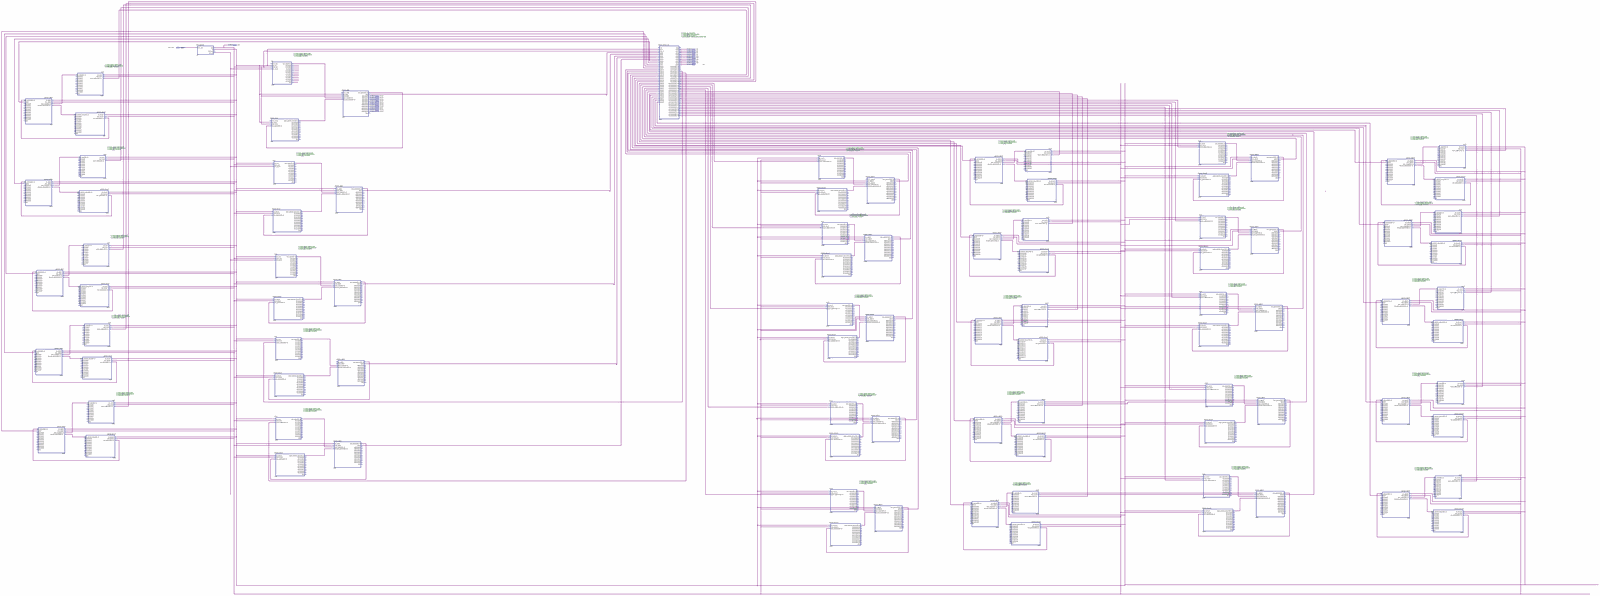
[diagram p0: schematic sheet, whole]
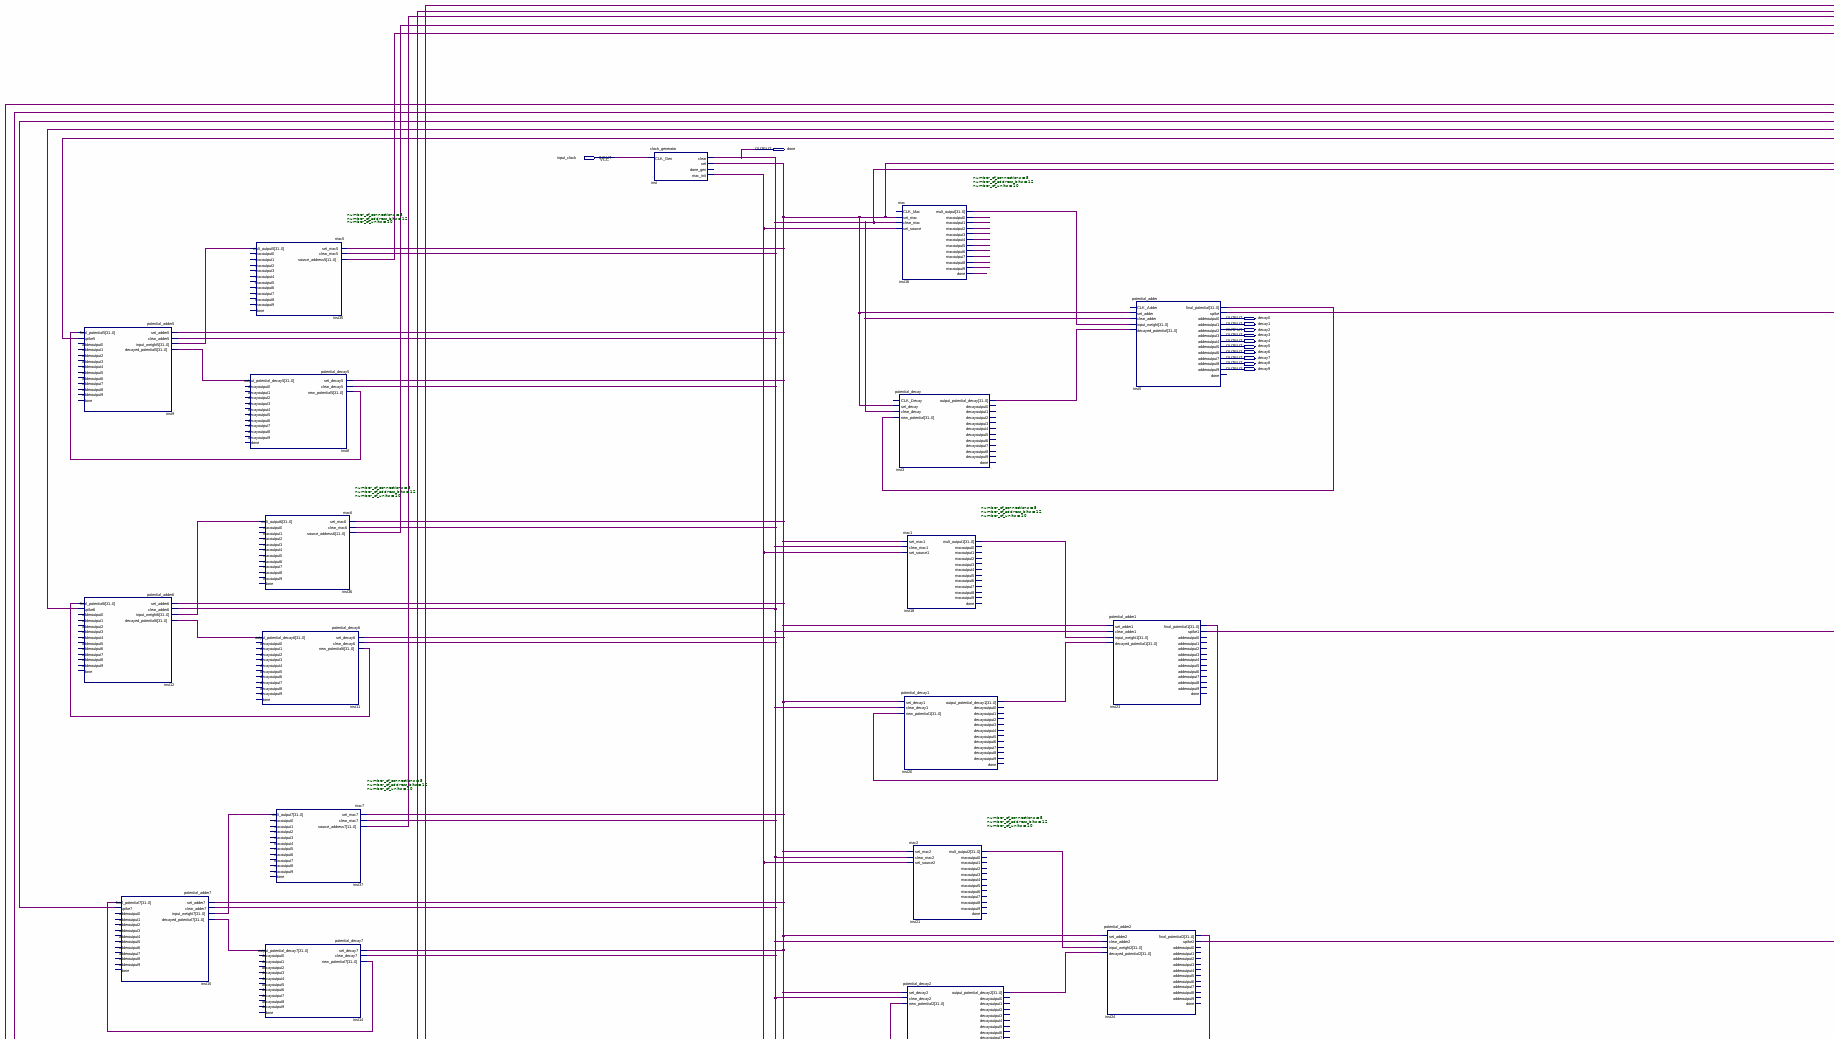
[diagram p1: schematic sheet, upper left part]
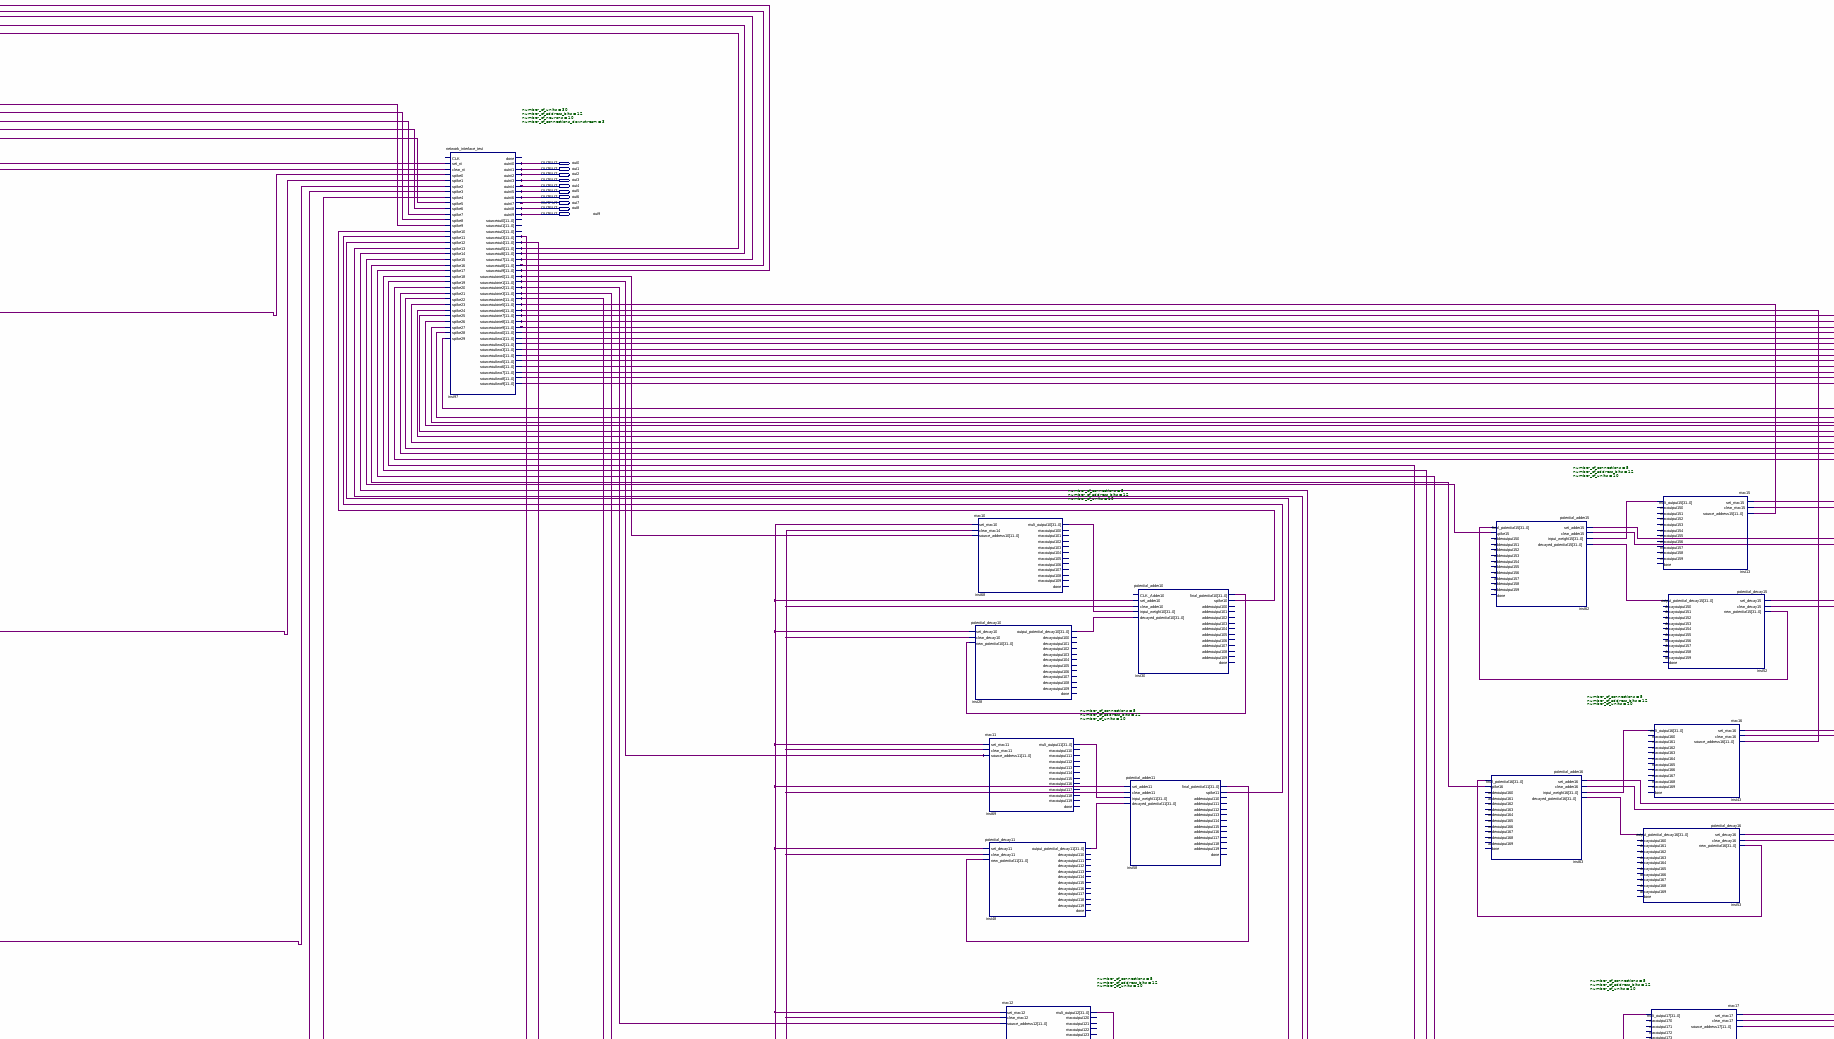
[diagram p2: schematic sheet, upper centre part]
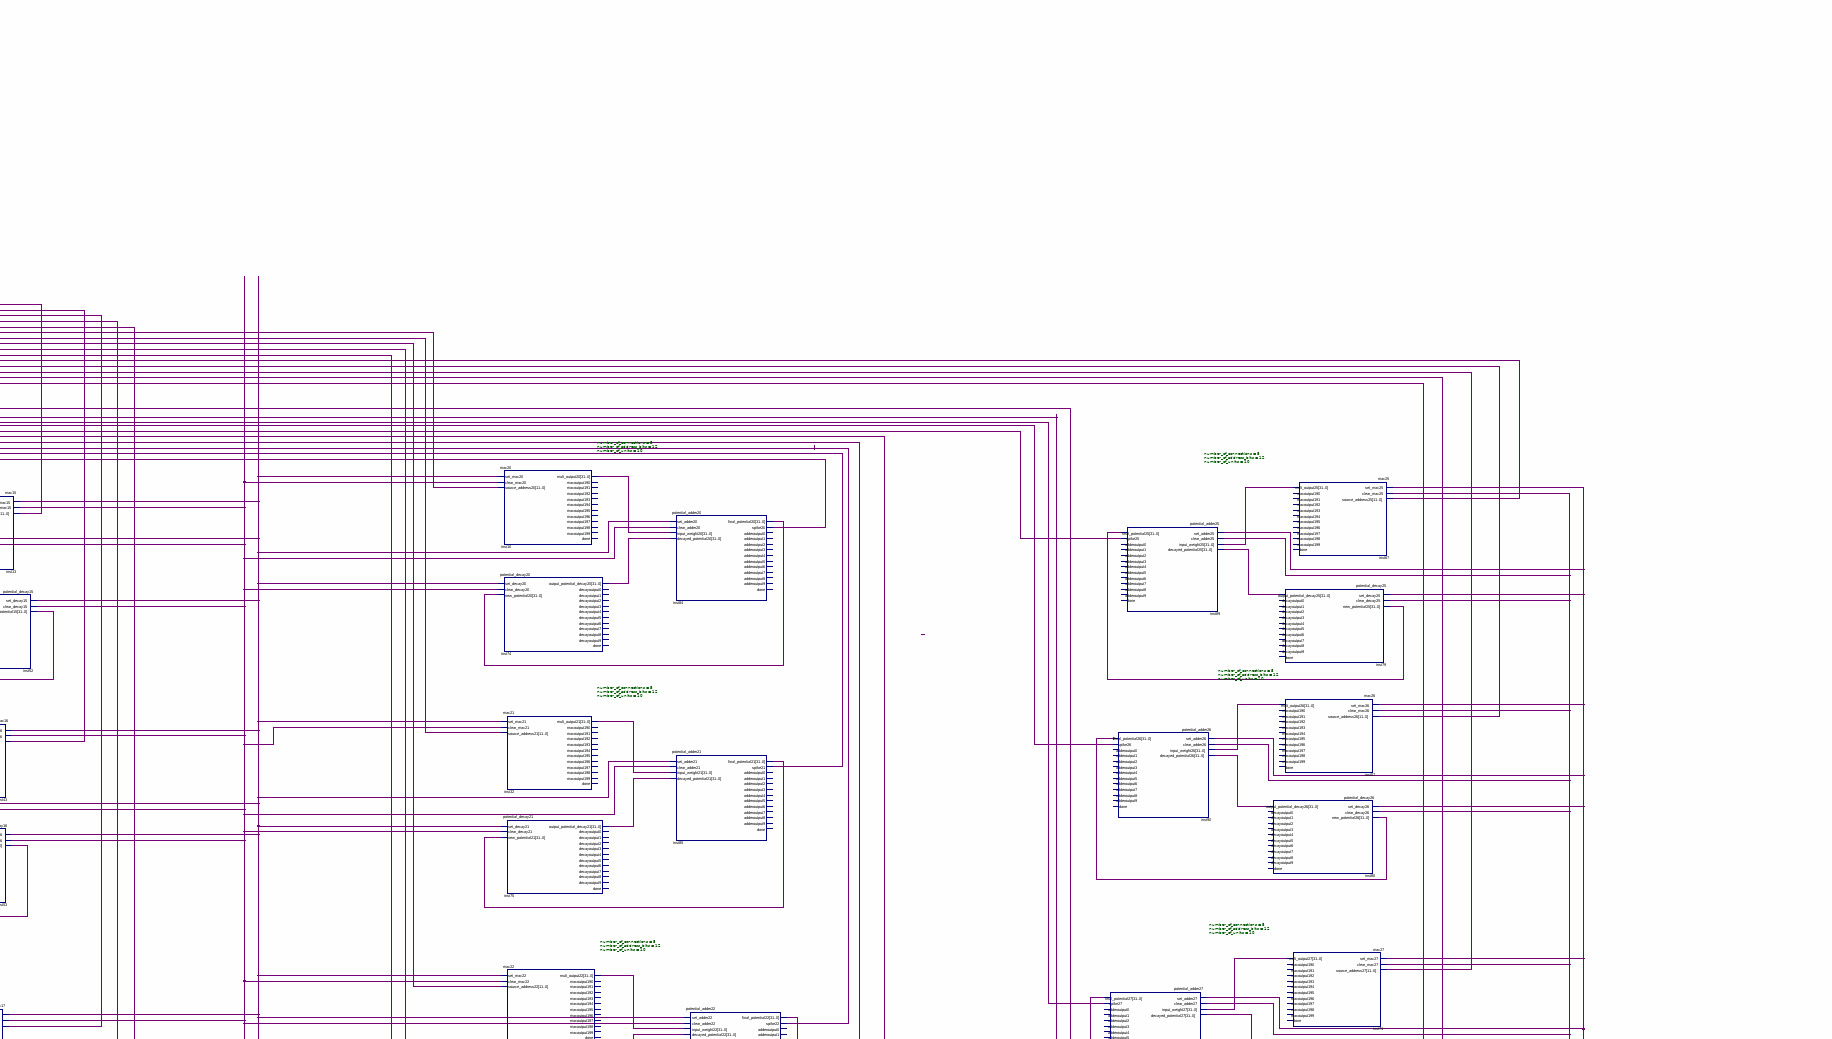
[diagram p3: schematic sheet, upper right part]
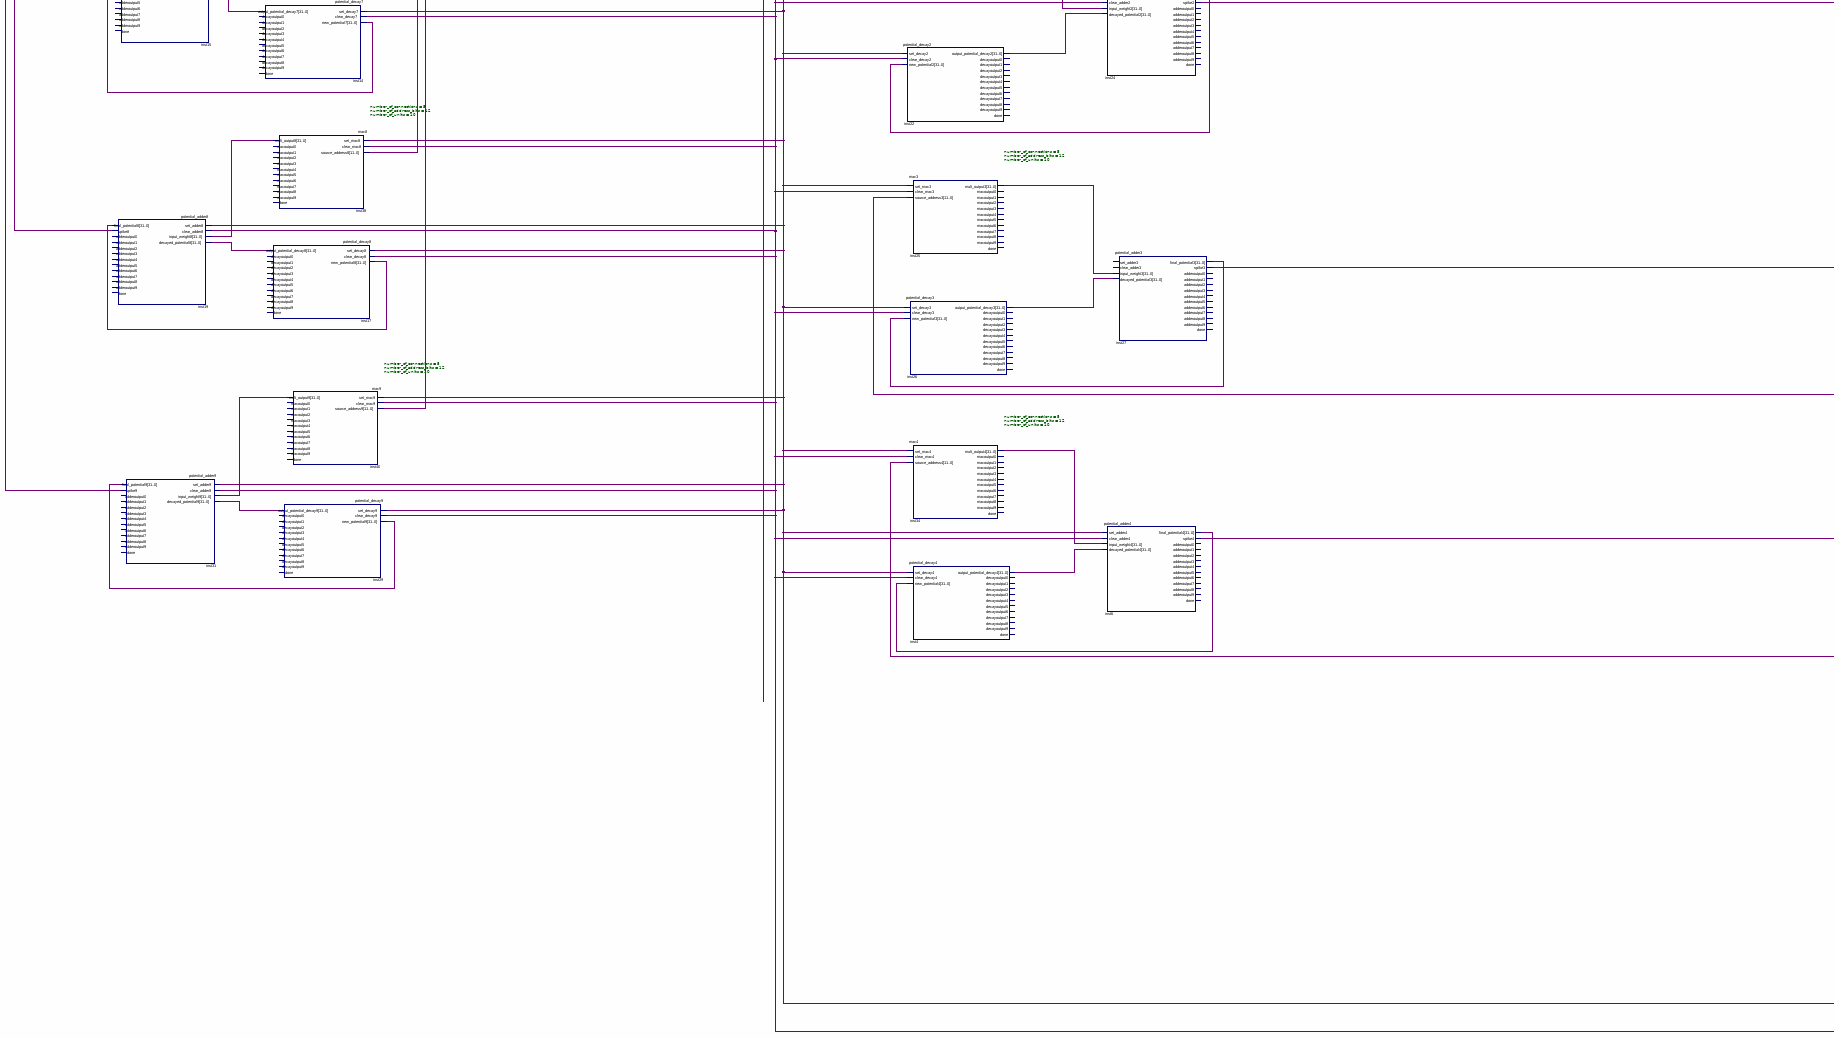
[diagram p4: schematic sheet, lower left part]
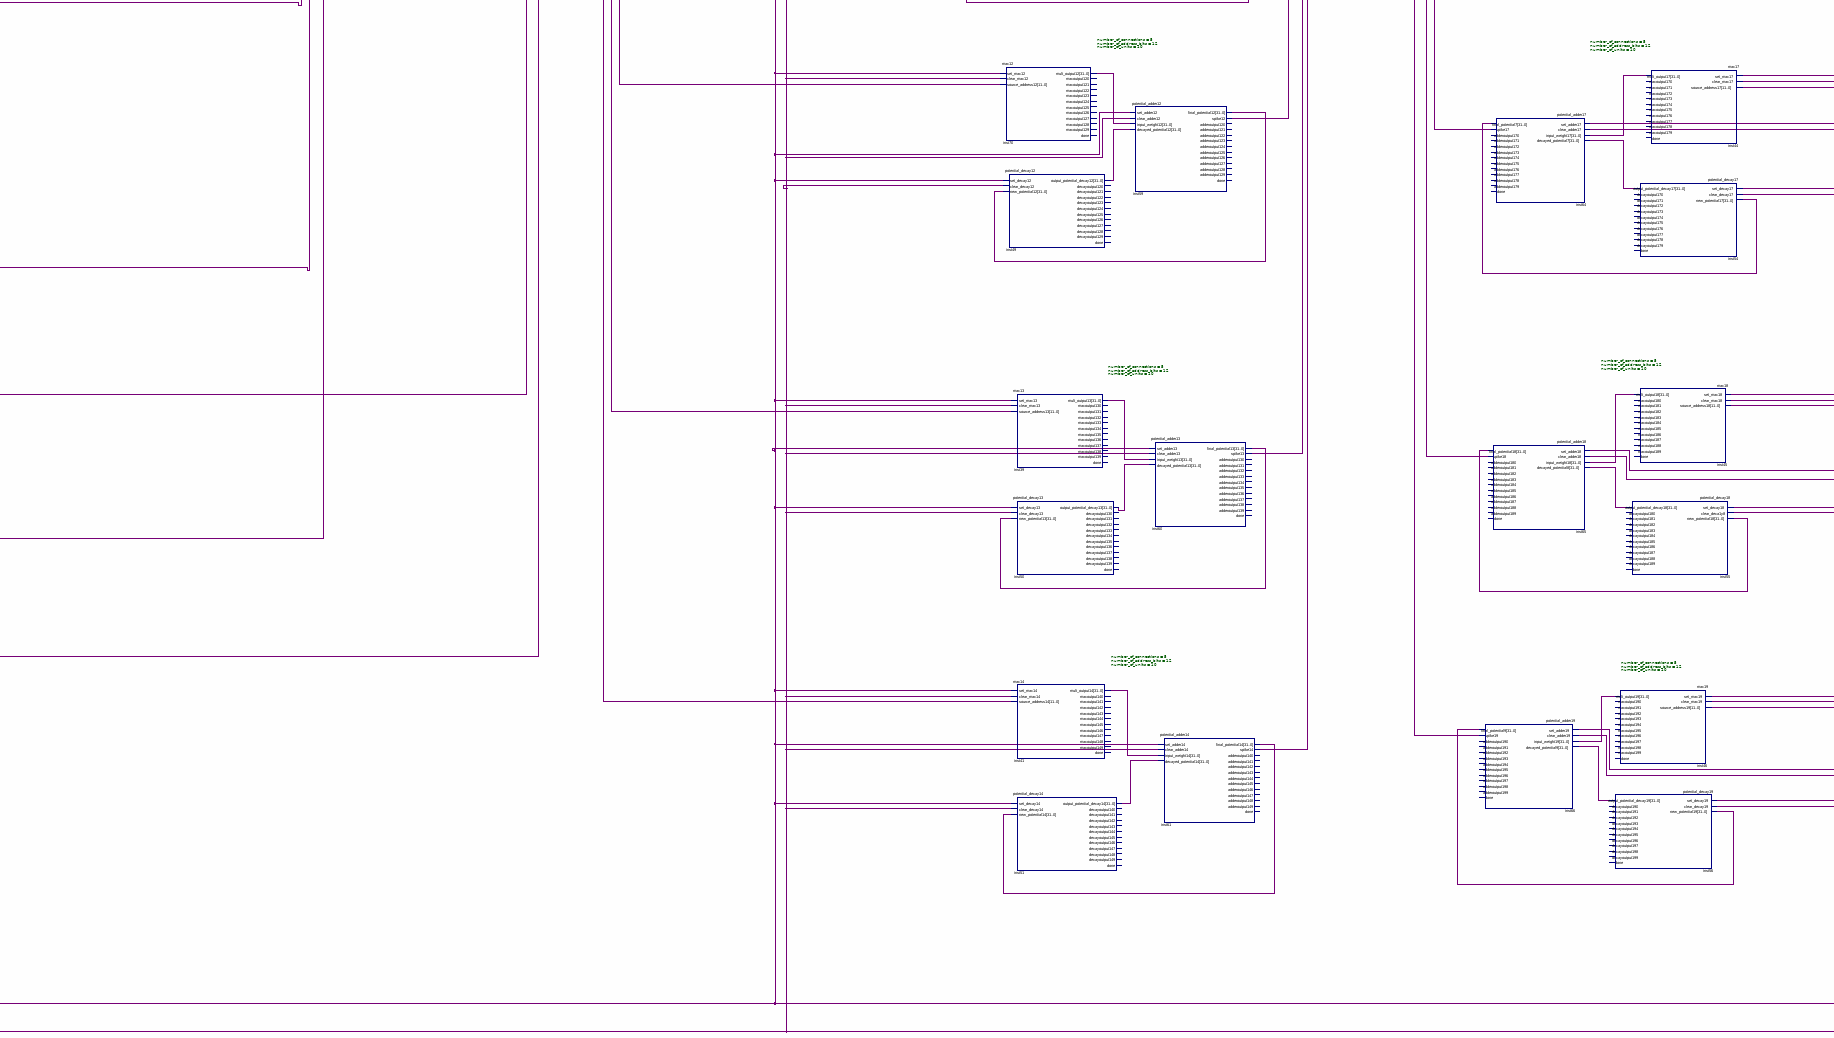
[diagram p5: schematic sheet, lower centre part]
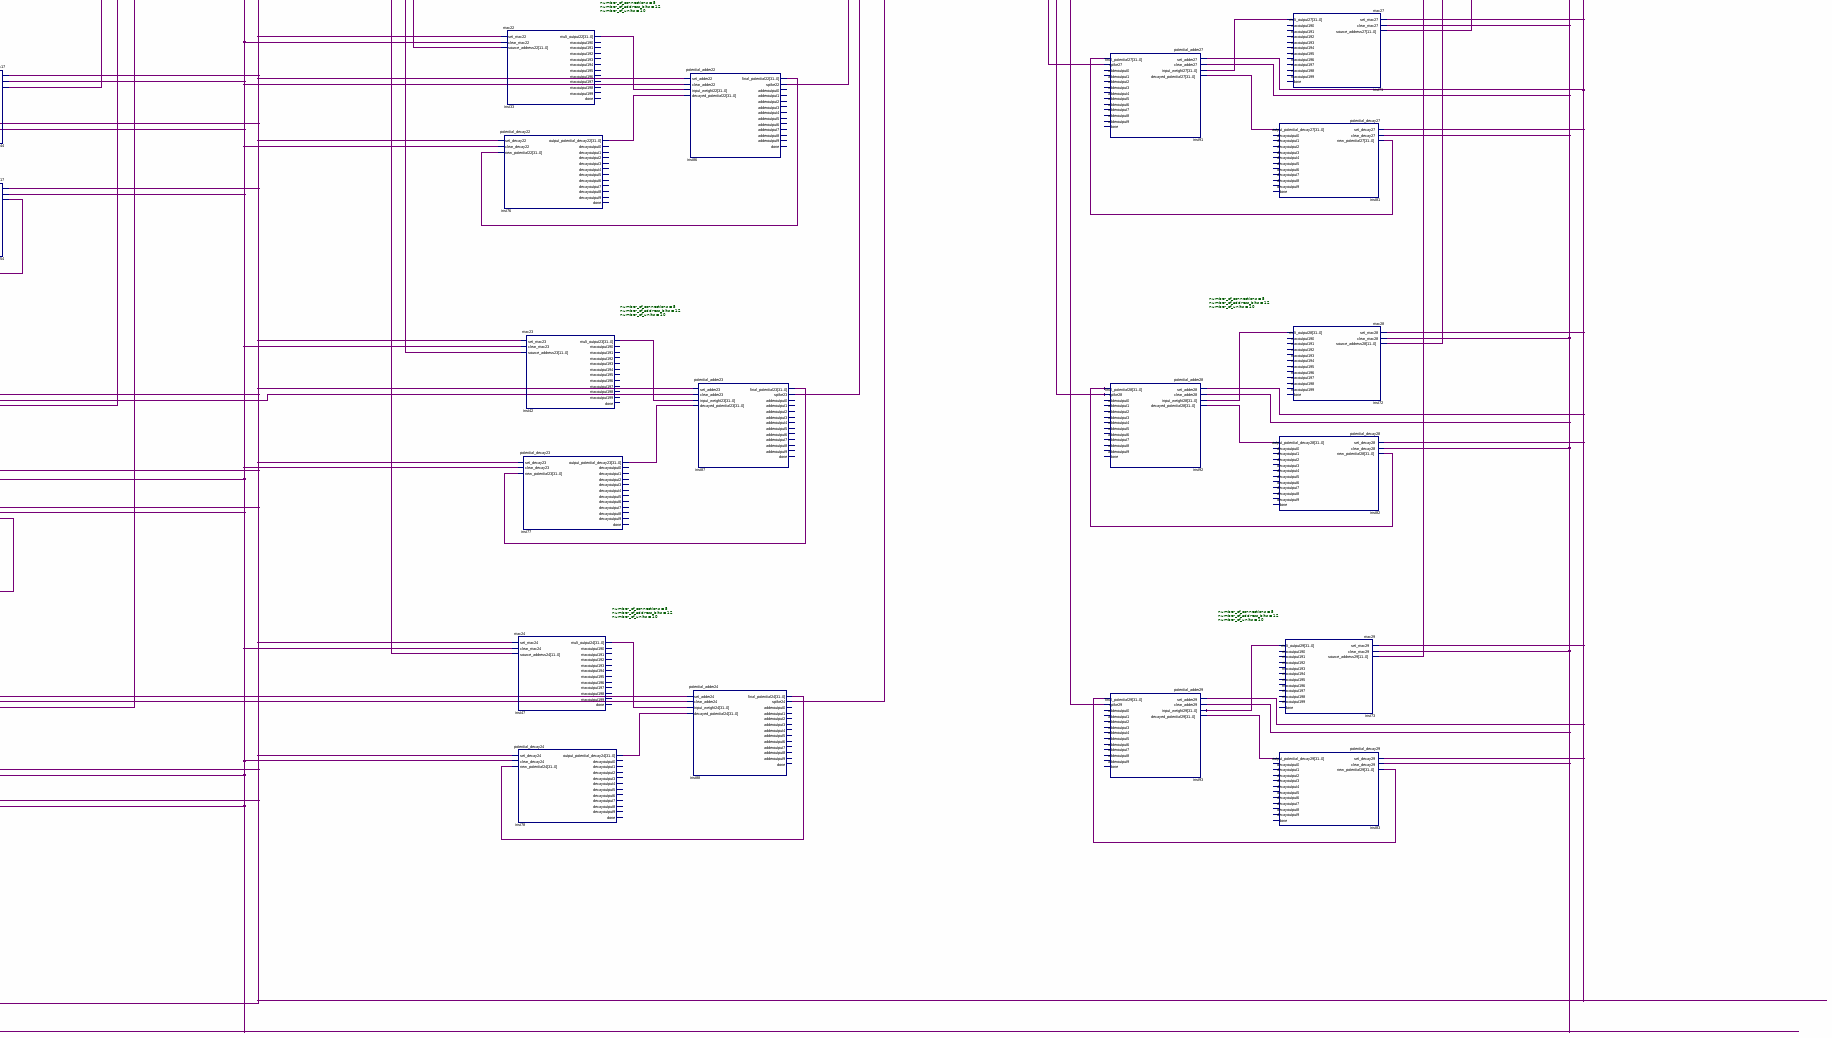
[diagram p6: schematic sheet, lower right part]
// Quartus schematic accelerator_toplevel.bdf as structural Verilog: 92 symbols, 22 pins
module accelerator_toplevel (
  input  input_clock,
  output done,
  output out0,
  output out1,
  output out2,
  output out3,
  output out4,
  output out5,
  output out6,
  output out7,
  output out8,
  output out9,
  output decay0,
  output decay1,
  output decay2,
  output decay3,
  output decay4,
  output decay5,
  output decay6,
  output decay7,
  output decay8,
  output decay9
);

  wire inst5_spike, inst6_spike4, inst9_spike5, inst12_spike6, inst15_spike7, inst16_done, inst16_macoutput0,
       inst16_macoutput1, inst16_macoutput2, inst16_macoutput3, inst16_macoutput4, inst16_macoutput5,
       inst16_macoutput6, inst16_macoutput7, inst16_macoutput8, inst16_macoutput9, inst19_spike8,
       inst23_spike1, inst24_spike2, inst27_spike3, inst30_spike10, inst31_spike9, inst58_spike11,
       inst59_spike12, inst60_spike13, inst61_spike14, inst62_spike15, inst63_spike16, inst64_spike17,
       inst65_spike18, inst66_spike19, inst84_spike20, inst85_spike21, inst86_spike22, inst87_spike23,
       inst88_spike24, inst89_spike25, inst90_spike26, inst91_spike27, inst92_spike28, inst93_spike29,
       inst_mac_init, inst_set;
  wire [11:0] inst97_sourceout3, inst97_sourceout4, inst97_sourceout5, inst97_sourceout6, inst97_sourceout7,
       inst97_sourceout8, inst97_sourceout9, inst97_sourceoutone0, inst97_sourceoutone1,
       inst97_sourceoutone2, inst97_sourceoutone3, inst97_sourceoutone4, inst97_sourceoutone5,
       inst97_sourceoutone6, inst97_sourceoutone7, inst97_sourceoutone8, inst97_sourceoutone9,
       inst97_sourceouttwo0, inst97_sourceouttwo1, inst97_sourceouttwo2, inst97_sourceouttwo3,
       inst97_sourceouttwo4, inst97_sourceouttwo5, inst97_sourceouttwo6, inst97_sourceouttwo7,
       inst97_sourceouttwo8, inst97_sourceouttwo9;
  wire [31:0] inst3_output_potential_decay, inst4_output_potential_decay4, inst5_final_potential,
       inst6_final_potential4, inst8_output_potential_decay5, inst9_final_potential5, inst10_mult_output20,
       inst11_output_potential_decay6, inst12_final_potential6, inst13_mult_output15,
       inst14_output_potential_decay7, inst15_final_potential7, inst16_mult_output,
       inst17_output_potential_decay8, inst18_mult_output1, inst19_final_potential8,
       inst20_output_potential_decay1, inst21_mult_output2, inst22_output_potential_decay2,
       inst23_final_potential1, inst24_final_potential2, inst25_mult_output3, inst26_output_potential_decay3,
       inst27_final_potential3, inst28_output_potential_decay10, inst29_output_potential_decay9,
       inst30_final_potential10, inst31_final_potential9, inst32_mult_output21, inst33_mult_output22,
       inst34_mult_output4, inst35_mult_output5, inst36_mult_output6, inst37_mult_output7,
       inst38_mult_output8, inst39_mult_output13, inst40_mult_output9, inst41_mult_output14,
       inst42_mult_output23, inst43_mult_output16, inst44_mult_output17, inst45_mult_output18,
       inst46_mult_output19, inst47_mult_output24, inst48_output_potential_decay11,
       inst49_output_potential_decay12, inst50_output_potential_decay13, inst51_output_potential_decay14,
       inst52_output_potential_decay15, inst53_output_potential_decay16, inst54_output_potential_decay17,
       inst55_output_potential_decay18, inst56_output_potential_decay19, inst57_mult_output26,
       inst58_final_potential11, inst59_final_potential12, inst60_final_potential13,
       inst61_final_potential14, inst62_final_potential15, inst63_final_potential16, inst64_final_potential7,
       inst65_final_potential18, inst66_final_potential9, inst67_mult_output25, inst68_mult_output10,
       inst69_mult_output11, inst70_mult_output12, inst71_mult_output27, inst72_mult_output28,
       inst73_mult_output29, inst74_output_potential_decay20, inst75_output_potential_decay21,
       inst76_output_potential_decay22, inst77_output_potential_decay23, inst78_output_potential_decay24,
       inst79_output_potential_decay25, inst80_output_potential_decay26, inst81_output_potential_decay27,
       inst82_output_potential_decay28, inst83_output_potential_decay29, inst84_final_potential20,
       inst85_final_potential21, inst86_final_potential22, inst87_final_potential23,
       inst88_final_potential24, inst89_final_potential25, inst90_final_potential26,
       inst91_final_potential27, inst92_final_potential28, inst93_final_potential29;

  potential_adder5 inst9 (
    .set_adder5(inst_set), .clear_adder5(done), .input_weight5(inst35_mult_output5),
    .decayed_potential5(inst8_output_potential_decay5), .final_potential5(inst9_final_potential5),
    .spike5(inst9_spike5));  // open: adderoutput0, adderoutput1, adderoutput2, adderoutput3, adderoutput4, adderoutput5, adderoutput6, adderoutput7, adderoutput8, adderoutput9, done
  potential_adder6 inst12 (
    .set_adder6(inst_set), .clear_adder6(done), .input_weight6(inst36_mult_output6),
    .decayed_potential6(inst11_output_potential_decay6), .final_potential6(inst12_final_potential6),
    .spike6(inst12_spike6));  // open: adderoutput0, adderoutput1, adderoutput2, adderoutput3, adderoutput4, adderoutput5, adderoutput6, adderoutput7, adderoutput8, adderoutput9, done
  potential_adder7 inst15 (
    .set_adder7(inst_set), .clear_adder7(done), .input_weight7(inst37_mult_output7),
    .decayed_potential7(inst14_output_potential_decay7), .final_potential7(inst15_final_potential7),
    .spike7(inst15_spike7));  // open: adderoutput0, adderoutput1, adderoutput2, adderoutput3, adderoutput4, adderoutput5, adderoutput6, adderoutput7, adderoutput8, adderoutput9, done
  potential_adder8 inst19 (
    .set_adder8(inst_set), .clear_adder8(done), .input_weight8(inst38_mult_output8),
    .decayed_potential8(inst17_output_potential_decay8), .final_potential8(inst19_final_potential8),
    .spike8(inst19_spike8));  // open: adderoutput0, adderoutput1, adderoutput2, adderoutput3, adderoutput4, adderoutput5, adderoutput6, adderoutput7, adderoutput8, adderoutput9, done
  potential_adder9 inst31 (
    .set_adder9(inst_set), .clear_adder9(done), .input_weight9(inst40_mult_output9),
    .decayed_potential9(inst29_output_potential_decay9), .final_potential9(inst31_final_potential9),
    .spike9(inst31_spike9));  // open: adderoutput0, adderoutput1, adderoutput2, adderoutput3, adderoutput4, adderoutput5, adderoutput6, adderoutput7, adderoutput8, adderoutput9, done
  mac5 #(.number_of_connections(5), .number_of_address_bits(12), .number_of_units(10)) inst35 (
    .set_mac5(inst_set), .clear_mac5(done), .source_address5(inst97_sourceout5),
    .mult_output5(inst35_mult_output5));  // open: macoutput0, macoutput1, macoutput2, macoutput3, macoutput4, macoutput5, macoutput6, macoutput7, macoutput8, macoutput9, done
  potential_decay5 inst8 (
    .set_decay5(inst_set), .clear_decay5(done), .new_potential5(inst9_final_potential5),
    .output_potential_decay5(inst8_output_potential_decay5));  // open: decayoutput0, decayoutput1, decayoutput2, decayoutput3, decayoutput4, decayoutput5, decayoutput6, decayoutput7, decayoutput8, decayoutput9, done
  mac6 #(.number_of_connections(5), .number_of_address_bits(12), .number_of_units(10)) inst36 (
    .set_mac6(inst_set), .clear_mac6(done), .source_address6(inst97_sourceout6),
    .mult_output6(inst36_mult_output6));  // open: macoutput0, macoutput1, macoutput2, macoutput3, macoutput4, macoutput5, macoutput6, macoutput7, macoutput8, macoutput9, done
  potential_decay6 inst11 (
    .set_decay6(inst_set), .clear_decay6(done), .new_potential6(inst12_final_potential6),
    .output_potential_decay6(inst11_output_potential_decay6));  // open: decayoutput0, decayoutput1, decayoutput2, decayoutput3, decayoutput4, decayoutput5, decayoutput6, decayoutput7, decayoutput8, decayoutput9, done
  potential_decay7 inst14 (
    .set_decay7(inst_set), .clear_decay7(done), .new_potential7(inst15_final_potential7),
    .output_potential_decay7(inst14_output_potential_decay7));  // open: decayoutput0, decayoutput1, decayoutput2, decayoutput3, decayoutput4, decayoutput5, decayoutput6, decayoutput7, decayoutput8, decayoutput9, done
  mac7 #(.number_of_connections(5), .number_of_address_bits(12), .number_of_units(10)) inst37 (
    .set_mac7(inst_set), .clear_mac7(done), .source_address7(inst97_sourceout7),
    .mult_output7(inst37_mult_output7));  // open: macoutput0, macoutput1, macoutput2, macoutput3, macoutput4, macoutput5, macoutput6, macoutput7, macoutput8, macoutput9, done
  mac8 #(.number_of_connections(5), .number_of_address_bits(12), .number_of_units(10)) inst38 (
    .set_mac8(inst_set), .clear_mac8(done), .source_address8(inst97_sourceout8),
    .mult_output8(inst38_mult_output8));  // open: macoutput0, macoutput1, macoutput2, macoutput3, macoutput4, macoutput5, macoutput6, macoutput7, macoutput8, macoutput9, done
  potential_decay8 inst17 (
    .set_decay8(inst_set), .clear_decay8(done), .new_potential8(inst19_final_potential8),
    .output_potential_decay8(inst17_output_potential_decay8));  // open: decayoutput0, decayoutput1, decayoutput2, decayoutput3, decayoutput4, decayoutput5, decayoutput6, decayoutput7, decayoutput8, decayoutput9, done
  mac9 #(.number_of_connections(5), .number_of_address_bits(12), .number_of_units(10)) inst40 (
    .set_mac9(inst_set), .clear_mac9(done), .source_address9(inst97_sourceout9),
    .mult_output9(inst40_mult_output9));  // open: macoutput0, macoutput1, macoutput2, macoutput3, macoutput4, macoutput5, macoutput6, macoutput7, macoutput8, macoutput9, done
  potential_decay9 inst29 (
    .set_decay9(inst_set), .clear_decay9(done), .new_potential9(inst31_final_potential9),
    .output_potential_decay9(inst29_output_potential_decay9));  // open: decayoutput0, decayoutput1, decayoutput2, decayoutput3, decayoutput4, decayoutput5, decayoutput6, decayoutput7, decayoutput8, decayoutput9, done
  clock_generator inst (
    .CLK_Gen(input_clock), .clear(done), .set(inst_set), .mac_init(inst_mac_init));  // open: done_gen
  mac #(.number_of_connections(5), .number_of_address_bits(12), .number_of_units(10)) inst16 (
    .set_mac(inst_set), .clear_mac(done), .set_source(inst_mac_init), .mult_output(inst16_mult_output),
    .macoutput0(inst16_macoutput0), .macoutput1(inst16_macoutput1), .macoutput2(inst16_macoutput2),
    .macoutput3(inst16_macoutput3), .macoutput4(inst16_macoutput4), .macoutput5(inst16_macoutput5),
    .macoutput6(inst16_macoutput6), .macoutput7(inst16_macoutput7), .macoutput8(inst16_macoutput8),
    .macoutput9(inst16_macoutput9), .done(inst16_done));  // open: CLK_Mac
  potential_decay inst3 (
    .set_decay(inst_set), .clear_decay(done), .new_potential(inst5_final_potential),
    .output_potential_decay(inst3_output_potential_decay));  // open: CLK_Decay, decayoutput0, decayoutput1, decayoutput2, decayoutput3, decayoutput4, decayoutput5, decayoutput6, decayoutput7, decayoutput8, decayoutput9, done
  mac1 #(.number_of_connections(5), .number_of_address_bits(12), .number_of_units(10)) inst18 (
    .set_mac1(inst_set), .clear_mac1(done), .set_source1(inst_mac_init), .mult_output1(inst18_mult_output1));  // open: macoutput0, macoutput1, macoutput2, macoutput3, macoutput4, macoutput5, macoutput6, macoutput7, macoutput8, macoutput9, done
  potential_decay1 inst20 (
    .set_decay1(inst_set), .clear_decay1(done), .new_potential1(inst23_final_potential1),
    .output_potential_decay1(inst20_output_potential_decay1));  // open: decayoutput0, decayoutput1, decayoutput2, decayoutput3, decayoutput4, decayoutput5, decayoutput6, decayoutput7, decayoutput8, decayoutput9, done
  mac2 #(.number_of_connections(5), .number_of_address_bits(12), .number_of_units(10)) inst21 (
    .set_mac2(inst_set), .clear_mac2(done), .set_source2(inst_mac_init), .mult_output2(inst21_mult_output2));  // open: macoutput0, macoutput1, macoutput2, macoutput3, macoutput4, macoutput5, macoutput6, macoutput7, macoutput8, macoutput9, done
  potential_decay2 inst22 (
    .set_decay2(inst_set), .clear_decay2(done), .new_potential2(inst24_final_potential2),
    .output_potential_decay2(inst22_output_potential_decay2));  // open: decayoutput0, decayoutput1, decayoutput2, decayoutput3, decayoutput4, decayoutput5, decayoutput6, decayoutput7, decayoutput8, decayoutput9, done
  mac3 #(.number_of_connections(5), .number_of_address_bits(12), .number_of_units(10)) inst25 (
    .set_mac3(inst_set), .clear_mac3(done), .source_address3(inst97_sourceout3),
    .mult_output3(inst25_mult_output3));  // open: macoutput0, macoutput1, macoutput2, macoutput3, macoutput4, macoutput5, macoutput6, macoutput7, macoutput8, macoutput9, done
  potential_decay3 inst26 (
    .set_decay3(inst_set), .clear_decay3(done), .new_potential3(inst27_final_potential3),
    .output_potential_decay3(inst26_output_potential_decay3));  // open: decayoutput0, decayoutput1, decayoutput2, decayoutput3, decayoutput4, decayoutput5, decayoutput6, decayoutput7, decayoutput8, decayoutput9, done
  mac4 #(.number_of_connections(5), .number_of_address_bits(12), .number_of_units(10)) inst34 (
    .set_mac4(inst_set), .clear_mac4(done), .source_address4(inst97_sourceout4),
    .mult_output4(inst34_mult_output4));  // open: macoutput0, macoutput1, macoutput2, macoutput3, macoutput4, macoutput5, macoutput6, macoutput7, macoutput8, macoutput9, done
  potential_decay4 inst4 (
    .set_decay4(inst_set), .clear_decay4(done), .new_potential4(inst6_final_potential4),
    .output_potential_decay4(inst4_output_potential_decay4));  // open: decayoutput0, decayoutput1, decayoutput2, decayoutput3, decayoutput4, decayoutput5, decayoutput6, decayoutput7, decayoutput8, decayoutput9, done
  potential_adder1 inst23 (
    .set_adder1(inst_set), .clear_adder1(done), .input_weight1(inst18_mult_output1),
    .decayed_potential1(inst20_output_potential_decay1), .final_potential1(inst23_final_potential1),
    .spike1(inst23_spike1));  // open: adderoutput0, adderoutput1, adderoutput2, adderoutput3, adderoutput4, adderoutput5, adderoutput6, adderoutput7, adderoutput8, adderoutput9, done
  potential_adder2 inst24 (
    .set_adder2(inst_set), .clear_adder2(done), .input_weight2(inst21_mult_output2),
    .decayed_potential2(inst22_output_potential_decay2), .final_potential2(inst24_final_potential2),
    .spike2(inst24_spike2));  // open: adderoutput0, adderoutput1, adderoutput2, adderoutput3, adderoutput4, adderoutput5, adderoutput6, adderoutput7, adderoutput8, adderoutput9, done
  potential_adder3 inst27 (
    .input_weight3(inst25_mult_output3), .decayed_potential3(inst26_output_potential_decay3),
    .final_potential3(inst27_final_potential3), .spike3(inst27_spike3));  // open: set_adder3, clear_adder3, adderoutput0, adderoutput1, adderoutput2, adderoutput3, adderoutput4, adderoutput5, adderoutput6, adderoutput7, adderoutput8, adderoutput9, done
  potential_adder4 inst6 (
    .set_adder4(inst_set), .clear_adder4(done), .input_weight4(inst34_mult_output4),
    .decayed_potential4(inst4_output_potential_decay4), .final_potential4(inst6_final_potential4),
    .spike4(inst6_spike4));  // open: adderoutput0, adderoutput1, adderoutput2, adderoutput3, adderoutput4, adderoutput5, adderoutput6, adderoutput7, adderoutput8, adderoutput9, done
  potential_adder inst5 (
    .set_adder(inst_set), .clear_adder(done), .input_weight(inst16_mult_output),
    .decayed_potential(inst3_output_potential_decay), .final_potential(inst5_final_potential),
    .spike(inst5_spike), .adderoutput0(decay0), .adderoutput1(decay1), .adderoutput2(decay2),
    .adderoutput3(decay3), .adderoutput4(decay4), .adderoutput5(decay5), .adderoutput6(decay6),
    .adderoutput7(decay7), .adderoutput8(decay8), .adderoutput9(decay9));  // open: CLK_Adder, done
  network_interface_test #(.number_of_units(30), .number_of_address_bits(12), .number_of_neurons(10), .number_of_connections_downstream(3)) inst97 (
    .set_ni(inst_set), .clear_ni(done), .spike0(inst5_spike), .spike1(inst23_spike1), .spike2(inst24_spike2),
    .spike3(inst27_spike3), .spike4(inst6_spike4), .spike5(inst9_spike5), .spike6(inst12_spike6),
    .spike7(inst15_spike7), .spike8(inst19_spike8), .spike9(inst31_spike9), .spike10(inst30_spike10),
    .spike11(inst58_spike11), .spike12(inst59_spike12), .spike13(inst60_spike13), .spike14(inst61_spike14),
    .spike15(inst62_spike15), .spike16(inst63_spike16), .spike17(inst64_spike17), .spike18(inst65_spike18),
    .spike19(inst66_spike19), .spike20(inst84_spike20), .spike21(inst85_spike21), .spike22(inst86_spike22),
    .spike23(inst87_spike23), .spike24(inst88_spike24), .spike25(inst89_spike25), .spike26(inst90_spike26),
    .spike27(inst91_spike27), .spike28(inst92_spike28), .spike29(inst93_spike29), .outni0(out0),
    .outni1(out1), .outni2(out2), .outni3(out3), .outni4(out4), .outni5(out5), .outni6(out6), .outni7(out7),
    .outni8(out8), .outni9(out9), .sourceout3(inst97_sourceout3), .sourceout4(inst97_sourceout4),
    .sourceout5(inst97_sourceout5), .sourceout6(inst97_sourceout6), .sourceout7(inst97_sourceout7),
    .sourceout8(inst97_sourceout8), .sourceout9(inst97_sourceout9), .sourceoutone0(inst97_sourceoutone0),
    .sourceoutone1(inst97_sourceoutone1), .sourceoutone2(inst97_sourceoutone2),
    .sourceoutone3(inst97_sourceoutone3), .sourceoutone4(inst97_sourceoutone4),
    .sourceoutone5(inst97_sourceoutone5), .sourceoutone6(inst97_sourceoutone6),
    .sourceoutone7(inst97_sourceoutone7), .sourceoutone8(inst97_sourceoutone8),
    .sourceoutone9(inst97_sourceoutone9), .sourceouttwo0(inst97_sourceouttwo0),
    .sourceouttwo1(inst97_sourceouttwo1), .sourceouttwo2(inst97_sourceouttwo2),
    .sourceouttwo3(inst97_sourceouttwo3), .sourceouttwo4(inst97_sourceouttwo4),
    .sourceouttwo5(inst97_sourceouttwo5), .sourceouttwo6(inst97_sourceouttwo6),
    .sourceouttwo7(inst97_sourceouttwo7), .sourceouttwo8(inst97_sourceouttwo8),
    .sourceouttwo9(inst97_sourceouttwo9));  // open: CLK, done, sourceout0, sourceout1, sourceout2
  mac10 #(.number_of_connections(5), .number_of_address_bits(12), .number_of_units(10)) inst68 (
    .set_mac10(inst_set), .clear_mac14(done), .source_address10(inst97_sourceoutone0),
    .mult_output10(inst68_mult_output10));  // open: macoutput100, macoutput101, macoutput102, macoutput103, macoutput104, macoutput105, macoutput106, macoutput107, macoutput108, macoutput109, done
  potential_decay10 inst28 (
    .set_decay10(inst_set), .clear_decay10(done), .new_potential10(inst30_final_potential10),
    .output_potential_decay10(inst28_output_potential_decay10));  // open: decayoutput100, decayoutput101, decayoutput102, decayoutput103, decayoutput104, decayoutput105, decayoutput106, decayoutput107, decayoutput108, decayoutput109, done
  mac11 #(.number_of_connections(5), .number_of_address_bits(12), .number_of_units(10)) inst69 (
    .set_mac11(inst_set), .clear_mac11(done), .source_address11(inst97_sourceoutone1),
    .mult_output11(inst69_mult_output11));  // open: macoutput110, macoutput111, macoutput112, macoutput113, macoutput114, macoutput115, macoutput116, macoutput117, macoutput118, macoutput119, done
  potential_decay11 inst48 (
    .set_decay11(inst_set), .clear_decay11(done), .new_potential11(inst58_final_potential11),
    .output_potential_decay11(inst48_output_potential_decay11));  // open: decayoutput110, decayoutput111, decayoutput112, decayoutput113, decayoutput114, decayoutput115, decayoutput116, decayoutput117, decayoutput118, decayoutput119, done
  mac12 #(.number_of_connections(5), .number_of_address_bits(12), .number_of_units(10)) inst70 (
    .set_mac12(inst_set), .clear_mac12(done), .source_address12(inst97_sourceoutone2),
    .mult_output12(inst70_mult_output12));  // open: macoutput120, macoutput121, macoutput122, macoutput123, macoutput124, macoutput125, macoutput126, macoutput127, macoutput128, macoutput129, done
  potential_decay12 inst49 (
    .set_decay12(inst_set), .clear_decay12(done), .new_potential12(inst59_final_potential12),
    .output_potential_decay12(inst49_output_potential_decay12));  // open: decayoutput120, decayoutput121, decayoutput122, decayoutput123, decayoutput124, decayoutput125, decayoutput126, decayoutput127, decayoutput128, decayoutput129, done
  mac13 #(.number_of_connections(5), .number_of_address_bits(12), .number_of_units(10)) inst39 (
    .set_mac13(inst_set), .clear_mac13(done), .source_address13(inst97_sourceoutone3),
    .mult_output13(inst39_mult_output13));  // open: macoutput130, macoutput131, macoutput132, macoutput133, macoutput134, macoutput135, macoutput136, macoutput137, macoutput138, macoutput139, done
  potential_decay13 inst50 (
    .set_decay13(inst_set), .clear_decay13(done), .new_potential13(inst60_final_potential13),
    .output_potential_decay13(inst50_output_potential_decay13));  // open: decayoutput130, decayoutput131, decayoutput132, decayoutput133, decayoutput134, decayoutput135, decayoutput136, decayoutput137, decayoutput138, decayoutput139, done
  mac14 #(.number_of_connections(5), .number_of_address_bits(12), .number_of_units(10)) inst41 (
    .set_mac14(inst_set), .clear_mac14(done), .source_address14(inst97_sourceoutone4),
    .mult_output14(inst41_mult_output14));  // open: macoutput140, macoutput141, macoutput142, macoutput143, macoutput144, macoutput145, macoutput146, macoutput147, macoutput148, macoutput149, done
  potential_decay14 inst51 (
    .set_decay14(inst_set), .clear_decay14(done), .new_potential14(inst61_final_potential14),
    .output_potential_decay14(inst51_output_potential_decay14));  // open: decayoutput140, decayoutput141, decayoutput142, decayoutput143, decayoutput144, decayoutput145, decayoutput146, decayoutput147, decayoutput148, decayoutput149, done
  potential_adder11 inst58 (
    .set_adder11(inst_set), .clear_adder11(done), .input_weight11(inst69_mult_output11),
    .decayed_potential11(inst48_output_potential_decay11), .final_potential11(inst58_final_potential11),
    .spike11(inst58_spike11));  // open: adderoutput110, adderoutput111, adderoutput112, adderoutput113, adderoutput114, adderoutput115, adderoutput116, adderoutput117, adderoutput118, adderoutput119, done
  potential_adder10 inst30 (
    .set_adder10(inst_set), .clear_adder10(done), .input_weight10(inst68_mult_output10),
    .decayed_potential10(inst28_output_potential_decay10), .final_potential10(inst30_final_potential10),
    .spike10(inst30_spike10));  // open: CLK_Adder10, adderoutput100, adderoutput101, adderoutput102, adderoutput103, adderoutput104, adderoutput105, adderoutput106, adderoutput107, adderoutput108, adderoutput109, done
  potential_adder12 inst59 (
    .set_adder12(inst_set), .clear_adder12(done), .input_weight12(inst70_mult_output12),
    .decayed_potential12(inst49_output_potential_decay12), .final_potential12(inst59_final_potential12),
    .spike12(inst59_spike12));  // open: adderoutput120, adderoutput121, adderoutput122, adderoutput123, adderoutput124, adderoutput125, adderoutput126, adderoutput127, adderoutput128, adderoutput129, done
  potential_adder13 inst60 (
    .set_adder13(inst_set), .clear_adder13(done), .input_weight13(inst39_mult_output13),
    .decayed_potential13(inst50_output_potential_decay13), .final_potential13(inst60_final_potential13),
    .spike13(inst60_spike13));  // open: adderoutput130, adderoutput131, adderoutput132, adderoutput133, adderoutput134, adderoutput135, adderoutput136, adderoutput137, adderoutput138, adderoutput139, done
  potential_adder14 inst61 (
    .set_adder14(inst_set), .clear_adder14(done), .input_weight14(inst41_mult_output14),
    .decayed_potential14(inst51_output_potential_decay14), .final_potential14(inst61_final_potential14),
    .spike14(inst61_spike14));  // open: adderoutput140, adderoutput141, adderoutput142, adderoutput143, adderoutput144, adderoutput145, adderoutput146, adderoutput147, adderoutput148, adderoutput149, done
  potential_adder16 inst63 (
    .set_adder16(inst_set), .clear_adder16(done), .input_weight16(inst43_mult_output16),
    .decayed_potential16(inst53_output_potential_decay16), .final_potential16(inst63_final_potential16),
    .spike16(inst63_spike16));  // open: adderoutput160, adderoutput161, adderoutput162, adderoutput163, adderoutput164, adderoutput165, adderoutput166, adderoutput167, adderoutput168, adderoutput169, done
  potential_adder19 inst66 (
    .set_adder19(inst_set), .clear_adder19(done), .input_weight19(inst46_mult_output19),
    .decayed_potential9(inst56_output_potential_decay19), .final_potential9(inst66_final_potential9),
    .spike19(inst66_spike19));  // open: adderoutput190, adderoutput191, adderoutput192, adderoutput193, adderoutput194, adderoutput195, adderoutput196, adderoutput197, adderoutput198, adderoutput199, done
  potential_adder15 inst62 (
    .set_adder15(inst_set), .clear_adder15(done), .input_weight15(inst13_mult_output15),
    .decayed_potential15(inst52_output_potential_decay15), .final_potential15(inst62_final_potential15),
    .spike15(inst62_spike15));  // open: adderoutput150, adderoutput151, adderoutput152, adderoutput153, adderoutput154, adderoutput155, adderoutput156, adderoutput157, adderoutput158, adderoutput159, done
  potential_adder17 inst64 (
    .set_adder17(inst_set), .clear_adder17(done), .input_weight17(inst44_mult_output17),
    .decayed_potential7(inst54_output_potential_decay17), .final_potential7(inst64_final_potential7),
    .spike17(inst64_spike17));  // open: adderoutput170, adderoutput171, adderoutput172, adderoutput173, adderoutput174, adderoutput175, adderoutput176, adderoutput177, adderoutput178, adderoutput179, done
  potential_adder18 inst65 (
    .set_adder18(inst_set), .clear_adder18(done), .input_weight18(inst45_mult_output18),
    .decayed_potential8(inst55_output_potential_decay18), .final_potential18(inst65_final_potential18),
    .spike18(inst65_spike18));  // open: adderoutput180, adderoutput181, adderoutput182, adderoutput183, adderoutput184, adderoutput185, adderoutput186, adderoutput187, adderoutput188, adderoutput189, done
  mac19 #(.number_of_connections(5), .number_of_address_bits(12), .number_of_units(10)) inst46 (
    .set_mac19(inst_set), .clear_mac19(done), .source_address19(inst97_sourceoutone9),
    .mult_output19(inst46_mult_output19));  // open: macoutput190, macoutput191, macoutput192, macoutput193, macoutput194, macoutput195, macoutput196, macoutput197, macoutput198, macoutput199, done
  potential_decay19 inst56 (
    .set_decay19(inst_set), .clear_decay19(done), .new_potential19(inst66_final_potential9),
    .output_potential_decay19(inst56_output_potential_decay19));  // open: decayoutput190, decayoutput191, decayoutput192, decayoutput193, decayoutput194, decayoutput195, decayoutput196, decayoutput197, decayoutput198, decayoutput199, done
  potential_decay16 inst53 (
    .set_decay16(inst_set), .clear_decay16(done), .new_potential16(inst63_final_potential16),
    .output_potential_decay16(inst53_output_potential_decay16));  // open: decayoutput160, decayoutput161, decayoutput162, decayoutput163, decayoutput164, decayoutput165, decayoutput166, decayoutput167, decayoutput168, decayoutput169, done
  potential_decay17 inst54 (
    .set_decay17(inst_set), .clear_decay17(done), .new_potential17(inst64_final_potential7),
    .output_potential_decay17(inst54_output_potential_decay17));  // open: decayoutput170, decayoutput171, decayoutput172, decayoutput173, decayoutput174, decayoutput175, decayoutput176, decayoutput177, decayoutput178, decayoutput179, done
  mac18 #(.number_of_connections(5), .number_of_address_bits(12), .number_of_units(10)) inst45 (
    .set_mac18(inst_set), .clear_mac18(done), .source_address18(inst97_sourceoutone8),
    .mult_output18(inst45_mult_output18));  // open: macoutput180, macoutput181, macoutput182, macoutput183, macoutput184, macoutput185, macoutput186, macoutput187, macoutput188, macoutput189, done
  potential_decay18 inst55 (
    .set_decay18(inst_set), .clear_deca1y8(done), .new_potential18(inst65_final_potential18),
    .output_potential_decay18(inst55_output_potential_decay18));  // open: decayoutput180, decayoutput181, decayoutput182, decayoutput183, decayoutput184, decayoutput185, decayoutput186, decayoutput187, decayoutput188, decayoutput189, done
  mac15 #(.number_of_connections(5), .number_of_address_bits(12), .number_of_units(10)) inst13 (
    .set_mac15(inst_set), .clear_mac15(done), .source_address15(inst97_sourceoutone5),
    .mult_output15(inst13_mult_output15));  // open: macoutput150, macoutput151, macoutput152, macoutput153, macoutput154, macoutput155, macoutput156, macoutput157, macoutput158, macoutput159, done
  potential_decay15 inst52 (
    .set_decay15(inst_set), .clear_decay15(done), .new_potential15(inst62_final_potential15),
    .output_potential_decay15(inst52_output_potential_decay15));  // open: decayoutput150, decayoutput151, decayoutput152, decayoutput153, decayoutput154, decayoutput155, decayoutput156, decayoutput157, decayoutput158, decayoutput159, done
  mac16 #(.number_of_connections(5), .number_of_address_bits(12), .number_of_units(10)) inst43 (
    .set_mac16(inst_set), .clear_mac16(done), .source_address16(inst97_sourceoutone6),
    .mult_output16(inst43_mult_output16));  // open: macoutput160, macoutput161, macoutput162, macoutput163, macoutput164, macoutput165, macoutput166, macoutput167, macoutput168, macoutput169, done
  mac17 #(.number_of_connections(5), .number_of_address_bits(12), .number_of_units(10)) inst44 (
    .set_mac17(inst_set), .clear_mac17(done), .source_address17(inst97_sourceoutone7),
    .mult_output17(inst44_mult_output17));  // open: macoutput170, macoutput171, macoutput172, macoutput173, macoutput174, macoutput175, macoutput176, macoutput177, macoutput178, macoutput179, done
  mac20 #(.number_of_connections(5), .number_of_address_bits(12), .number_of_units(10)) inst10 (
    .set_mac20(inst_set), .clear_mac20(done), .source_address20(inst97_sourceouttwo0),
    .mult_output20(inst10_mult_output20));  // open: macoutput190, macoutput191, macoutput192, macoutput193, macoutput194, macoutput195, macoutput196, macoutput197, macoutput198, macoutput199, done
  potential_decay20 inst74 (
    .set_decay20(inst_set), .clear_decay20(done), .new_potential20(inst84_final_potential20),
    .output_potential_decay20(inst74_output_potential_decay20));  // open: decayoutput0, decayoutput1, decayoutput2, decayoutput3, decayoutput4, decayoutput5, decayoutput6, decayoutput7, decayoutput8, decayoutput9, done
  mac21 #(.number_of_connections(5), .number_of_address_bits(12), .number_of_units(10)) inst32 (
    .set_mac21(inst_set), .clear_mac21(done), .source_address21(inst97_sourceouttwo1),
    .mult_output21(inst32_mult_output21));  // open: macoutput190, macoutput191, macoutput192, macoutput193, macoutput194, macoutput195, macoutput196, macoutput197, macoutput198, macoutput199, done
  potential_decay21 inst75 (
    .set_decay21(inst_set), .clear_decay21(done), .new_potential21(inst85_final_potential21),
    .output_potential_decay21(inst75_output_potential_decay21));  // open: decayoutput0, decayoutput1, decayoutput2, decayoutput3, decayoutput4, decayoutput5, decayoutput6, decayoutput7, decayoutput8, decayoutput9, done
  mac22 #(.number_of_connections(5), .number_of_address_bits(12), .number_of_units(10)) inst33 (
    .set_mac22(inst_set), .clear_mac22(done), .source_address22(inst97_sourceouttwo2),
    .mult_output22(inst33_mult_output22));  // open: macoutput190, macoutput191, macoutput192, macoutput193, macoutput194, macoutput195, macoutput196, macoutput197, macoutput198, macoutput199, done
  potential_decay22 inst76 (
    .set_decay22(inst_set), .clear_decay22(done), .new_potential22(inst86_final_potential22),
    .output_potential_decay22(inst76_output_potential_decay22));  // open: decayoutput0, decayoutput1, decayoutput2, decayoutput3, decayoutput4, decayoutput5, decayoutput6, decayoutput7, decayoutput8, decayoutput9, done
  potential_decay23 inst77 (
    .set_decay23(inst_set), .clear_decay23(done), .new_potential23(inst87_final_potential23),
    .output_potential_decay23(inst77_output_potential_decay23));  // open: decayoutput0, decayoutput1, decayoutput2, decayoutput3, decayoutput4, decayoutput5, decayoutput6, decayoutput7, decayoutput8, decayoutput9, done
  mac24 #(.number_of_connections(5), .number_of_address_bits(12), .number_of_units(10)) inst47 (
    .set_mac24(inst_set), .clear_mac24(done), .source_address24(inst97_sourceouttwo4),
    .mult_output24(inst47_mult_output24));  // open: macoutput190, macoutput191, macoutput192, macoutput193, macoutput194, macoutput195, macoutput196, macoutput197, macoutput198, macoutput199, done
  potential_decay24 inst78 (
    .set_decay24(inst_set), .clear_decay24(done), .new_potential24(inst88_final_potential24),
    .output_potential_decay24(inst78_output_potential_decay24));  // open: decayoutput0, decayoutput1, decayoutput2, decayoutput3, decayoutput4, decayoutput5, decayoutput6, decayoutput7, decayoutput8, decayoutput9, done
  mac23 #(.number_of_connections(5), .number_of_address_bits(12), .number_of_units(10)) inst42 (
    .set_mac23(inst_set), .clear_mac23(done), .source_address23(inst97_sourceouttwo3),
    .mult_output23(inst42_mult_output23));  // open: macoutput190, macoutput191, macoutput192, macoutput193, macoutput194, macoutput195, macoutput196, macoutput197, macoutput198, macoutput199, done
  potential_adder20 inst84 (
    .set_adder20(inst_set), .clear_adder20(done), .input_weight20(inst10_mult_output20),
    .decayed_potential20(inst74_output_potential_decay20), .final_potential20(inst84_final_potential20),
    .spike20(inst84_spike20));  // open: adderoutput0, adderoutput1, adderoutput2, adderoutput3, adderoutput4, adderoutput5, adderoutput6, adderoutput7, adderoutput8, adderoutput9, done
  potential_adder21 inst85 (
    .set_adder21(inst_set), .clear_adder21(done), .input_weight21(inst32_mult_output21),
    .decayed_potential21(inst75_output_potential_decay21), .final_potential21(inst85_final_potential21),
    .spike21(inst85_spike21));  // open: adderoutput0, adderoutput1, adderoutput2, adderoutput3, adderoutput4, adderoutput5, adderoutput6, adderoutput7, adderoutput8, adderoutput9, done
  potential_adder22 inst86 (
    .set_adder22(inst_set), .clear_adder22(done), .input_weight22(inst33_mult_output22),
    .decayed_potential22(inst76_output_potential_decay22), .final_potential22(inst86_final_potential22),
    .spike22(inst86_spike22));  // open: adderoutput0, adderoutput1, adderoutput2, adderoutput3, adderoutput4, adderoutput5, adderoutput6, adderoutput7, adderoutput8, adderoutput9, done
  potential_adder23 inst87 (
    .set_adder23(inst_set), .clear_adder23(done), .input_weight23(inst42_mult_output23),
    .decayed_potential23(inst77_output_potential_decay23), .final_potential23(inst87_final_potential23),
    .spike23(inst87_spike23));  // open: adderoutput0, adderoutput1, adderoutput2, adderoutput3, adderoutput4, adderoutput5, adderoutput6, adderoutput7, adderoutput8, adderoutput9, done
  potential_adder24 inst88 (
    .set_adder24(inst_set), .clear_adder24(done), .input_weight24(inst47_mult_output24),
    .decayed_potential24(inst78_output_potential_decay24), .final_potential24(inst88_final_potential24),
    .spike24(inst88_spike24));  // open: adderoutput0, adderoutput1, adderoutput2, adderoutput3, adderoutput4, adderoutput5, adderoutput6, adderoutput7, adderoutput8, adderoutput9, done
  potential_adder27 inst91 (
    .set_adder27(inst_set), .clear_adder27(done), .input_weight27(inst71_mult_output27),
    .decayed_potential27(inst81_output_potential_decay27), .final_potential27(inst91_final_potential27),
    .spike27(inst91_spike27));  // open: adderoutput0, adderoutput1, adderoutput2, adderoutput3, adderoutput4, adderoutput5, adderoutput6, adderoutput7, adderoutput8, adderoutput9, done
  potential_adder28 inst92 (
    .set_adder28(inst_set), .clear_adder28(done), .input_weight28(inst72_mult_output28),
    .decayed_potential28(inst82_output_potential_decay28), .final_potential28(inst92_final_potential28),
    .spike28(inst92_spike28));  // open: adderoutput0, adderoutput1, adderoutput2, adderoutput3, adderoutput4, adderoutput5, adderoutput6, adderoutput7, adderoutput8, adderoutput9, done
  potential_adder29 inst93 (
    .set_adder29(inst_set), .clear_adder29(done), .input_weight29(inst73_mult_output29),
    .decayed_potential29(inst83_output_potential_decay29), .final_potential29(inst93_final_potential29),
    .spike29(inst93_spike29));  // open: adderoutput0, adderoutput1, adderoutput2, adderoutput3, adderoutput4, adderoutput5, adderoutput6, adderoutput7, adderoutput8, adderoutput9, done
  potential_adder25 inst89 (
    .set_adder25(inst_set), .clear_adder25(done), .input_weight25(inst67_mult_output25),
    .decayed_potential25(inst79_output_potential_decay25), .final_potential25(inst89_final_potential25),
    .spike25(inst89_spike25));  // open: adderoutput0, adderoutput1, adderoutput2, adderoutput3, adderoutput4, adderoutput5, adderoutput6, adderoutput7, adderoutput8, adderoutput9, done
  potential_adder26 inst90 (
    .set_adder26(inst_set), .clear_adder26(done), .input_weight26(inst57_mult_output26),
    .decayed_potential26(inst80_output_potential_decay26), .final_potential26(inst90_final_potential26),
    .spike26(inst90_spike26));  // open: adderoutput0, adderoutput1, adderoutput2, adderoutput3, adderoutput4, adderoutput5, adderoutput6, adderoutput7, adderoutput8, adderoutput9, done
  potential_decay25 inst79 (
    .set_decay25(inst_set), .clear_decay25(done), .new_potential25(inst89_final_potential25),
    .output_potential_decay25(inst79_output_potential_decay25));  // open: decayoutput0, decayoutput1, decayoutput2, decayoutput3, decayoutput4, decayoutput5, decayoutput6, decayoutput7, decayoutput8, decayoutput9, done
  mac26 #(.number_of_connections(5), .number_of_address_bits(12), .number_of_units(10)) inst57 (
    .set_mac26(inst_set), .clear_mac26(done), .source_address26(inst97_sourceouttwo6),
    .mult_output26(inst57_mult_output26));  // open: macoutput190, macoutput191, macoutput192, macoutput193, macoutput194, macoutput195, macoutput196, macoutput197, macoutput198, macoutput199, done
  potential_decay26 inst80 (
    .set_decay26(inst_set), .clear_decay26(done), .new_potential26(inst90_final_potential26),
    .output_potential_decay26(inst80_output_potential_decay26));  // open: decayoutput0, decayoutput1, decayoutput2, decayoutput3, decayoutput4, decayoutput5, decayoutput6, decayoutput7, decayoutput8, decayoutput9, done
  potential_decay27 inst81 (
    .set_decay27(inst_set), .clear_decay27(done), .new_potential27(inst91_final_potential27),
    .output_potential_decay27(inst81_output_potential_decay27));  // open: decayoutput0, decayoutput1, decayoutput2, decayoutput3, decayoutput4, decayoutput5, decayoutput6, decayoutput7, decayoutput8, decayoutput9, done
  potential_decay28 inst82 (
    .set_decay28(inst_set), .clear_decay28(done), .new_potential28(inst92_final_potential28),
    .output_potential_decay28(inst82_output_potential_decay28));  // open: decayoutput0, decayoutput1, decayoutput2, decayoutput3, decayoutput4, decayoutput5, decayoutput6, decayoutput7, decayoutput8, decayoutput9, done
  mac29 #(.number_of_connections(5), .number_of_address_bits(12), .number_of_units(10)) inst73 (
    .set_mac29(inst_set), .clear_mac29(done), .source_address29(inst97_sourceouttwo9),
    .mult_output29(inst73_mult_output29));  // open: macoutput190, macoutput191, macoutput192, macoutput193, macoutput194, macoutput195, macoutput196, macoutput197, macoutput198, macoutput199, done
  potential_decay29 inst83 (
    .set_decay29(inst_set), .clear_decay29(done), .new_potential29(inst93_final_potential29),
    .output_potential_decay29(inst83_output_potential_decay29));  // open: decayoutput0, decayoutput1, decayoutput2, decayoutput3, decayoutput4, decayoutput5, decayoutput6, decayoutput7, decayoutput8, decayoutput9, done
  mac25 #(.number_of_connections(5), .number_of_address_bits(12), .number_of_units(10)) inst67 (
    .set_mac25(inst_set), .clear_mac25(done), .source_address25(inst97_sourceouttwo5),
    .mult_output25(inst67_mult_output25));  // open: macoutput190, macoutput191, macoutput192, macoutput193, macoutput194, macoutput195, macoutput196, macoutput197, macoutput198, macoutput199, done
  mac27 #(.number_of_connections(5), .number_of_address_bits(12), .number_of_units(10)) inst71 (
    .set_mac27(inst_set), .clear_mac27(done), .source_address27(inst97_sourceouttwo7),
    .mult_output27(inst71_mult_output27));  // open: macoutput190, macoutput191, macoutput192, macoutput193, macoutput194, macoutput195, macoutput196, macoutput197, macoutput198, macoutput199, done
  mac28 #(.number_of_connections(5), .number_of_address_bits(12), .number_of_units(10)) inst72 (
    .set_mac28(inst_set), .clear_mac28(done), .source_address28(inst97_sourceouttwo8),
    .mult_output28(inst72_mult_output28));  // open: macoutput190, macoutput191, macoutput192, macoutput193, macoutput194, macoutput195, macoutput196, macoutput197, macoutput198, macoutput199, done
endmodule
